# Altium project interface.PrjPcb
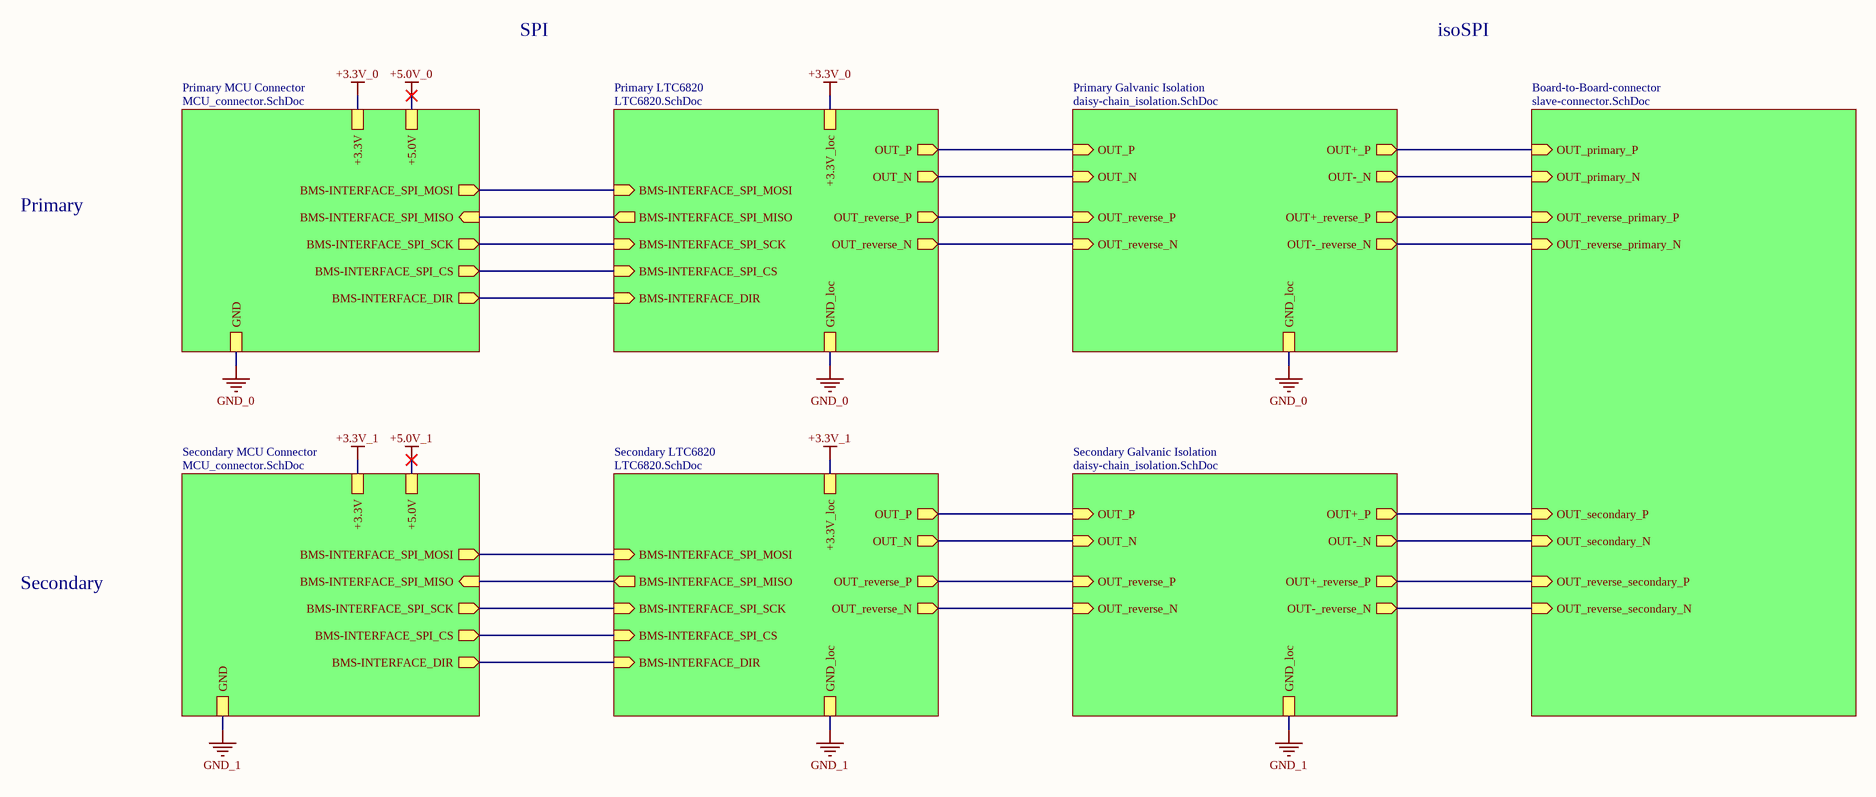
[diagram p0: overview.SchDoc]
GlobalDate: 2019-03-15; GlobalLicense: Creative Commons Attribution 4.0; GlobalProject: foxBMS BMS-Interface; GlobalVersion: 1.9.4
6 sheets, 74 parts. Net scope: strictly hierarchical (ports join the sheet entries above them; power ports are local).
Board file: interface.PcbDoc
Sheets:
  overview.SchDoc
    Primary LTC6820 = LTC6820.SchDoc
      LTC6820 forward = LTC6820_chip.SchDoc
      LTC6820 reverse = LTC6820_chip.SchDoc
    Primary Galvanic Isolation = daisy-chain_isolation.SchDoc
    Secondary LTC6820 = LTC6820.SchDoc
      LTC6820 forward = LTC6820_chip.SchDoc
      LTC6820 reverse = LTC6820_chip.SchDoc
    Secondary Galvanic Isolation = daisy-chain_isolation.SchDoc
    Board-to-Board-connector = slave-connector.SchDoc
    Primary MCU Connector = MCU_connector.SchDoc
    Secondary MCU Connector = MCU_connector.SchDoc

## Sheet overview.SchDoc: foxBMS BMS-Interface
size A3; DocumentNumber: 1; SheetNumber: 1; SheetTotal: 6; Author: Fraunhofer IISB foxBMS Team; REL-DATE: 2017-05-09; VERSION: 1.1.0; GateName_1: G$1; SymbolName_1: FRAME_B_L; LibraryName: foxBMS_BMS-Master_V1.00_A; DeviceSetName: FRAME_B_L; GateName_2: G$2; SymbolName_2: DOCFIELD; SheetDescription: Structure of Interface

### Sub-sheets
Board-to-Board-connector = slave-connector.SchDoc: OUT_secondary_N (in), OUT_secondary_P (in), OUT_primary_P (in), OUT_reverse_primary_N (in), OUT_primary_N (in), OUT_reverse_primary_P (in), OUT_reverse_secondary_P (in), OUT_reverse_secondary_N (in)
Primary Galvanic Isolation = daisy-chain_isolation.SchDoc: OUT_P (in), OUT_N (in), OUT+_P (out), OUT-_N (out), GND_loc, OUT_reverse_N (in), OUT_reverse_P (in), OUT+_reverse_P (out), OUT-_reverse_N (out)
Primary LTC6820 = LTC6820.SchDoc: BMS-INTERFACE_SPI_CS (in), BMS-INTERFACE_SPI_SCK (in), BMS-INTERFACE_SPI_MOSI (in), BMS-INTERFACE_SPI_MISO (out), OUT_P (out), OUT_N (out), +3.3V_loc, GND_loc, OUT_reverse_P (out), OUT_reverse_N (out), BMS-INTERFACE_DIR (in)
Primary MCU Connector = MCU_connector.SchDoc: GND, +3.3V, +5.0V, BMS-INTERFACE_SPI_MOSI (out), BMS-INTERFACE_SPI_MISO (in), BMS-INTERFACE_SPI_SCK (out), BMS-INTERFACE_SPI_CS (out), BMS-INTERFACE_DIR (out)
Secondary Galvanic Isolation = daisy-chain_isolation.SchDoc: OUT+_P (out), OUT-_N (out), OUT_P (in), OUT_N (in), GND_loc, OUT_reverse_P (in), OUT_reverse_N (in), OUT+_reverse_P (out), OUT-_reverse_N (out)
Secondary LTC6820 = LTC6820.SchDoc: BMS-INTERFACE_SPI_CS (in), BMS-INTERFACE_SPI_MOSI (in), BMS-INTERFACE_SPI_MISO (out), BMS-INTERFACE_SPI_SCK (in), OUT_N (out), OUT_P (out), +3.3V_loc, GND_loc, OUT_reverse_P (out), OUT_reverse_N (out), BMS-INTERFACE_DIR (in)
Secondary MCU Connector = MCU_connector.SchDoc: GND, +3.3V, +5.0V, BMS-INTERFACE_SPI_MOSI (out), BMS-INTERFACE_SPI_MISO (in), BMS-INTERFACE_SPI_SCK (out), BMS-INTERFACE_SPI_CS (out), BMS-INTERFACE_DIR (out)

### Nets
+3.3V_0: sheet Primary LTC6820/+3.3V_loc, sheet Primary MCU Connector/+3.3V
+3.3V_1: sheet Secondary LTC6820/+3.3V_loc, sheet Secondary MCU Connector/+3.3V
GND_0: sheet Primary LTC6820/GND_loc, sheet Primary Galvanic Isolation/GND_loc, sheet Primary MCU Connector/GND
GND_1: sheet Secondary LTC6820/GND_loc, sheet Secondary Galvanic Isolation/GND_loc, sheet Secondary MCU Connector/GND
BMS-INTERFACE_DIR: sheet Primary LTC6820/BMS-INTERFACE_DIR, sheet Primary MCU Connector/BMS-INTERFACE_DIR
BMS-INTERFACE_DIR: sheet Secondary LTC6820/BMS-INTERFACE_DIR, sheet Secondary MCU Connector/BMS-INTERFACE_DIR  [a separate net that carries the same name]
BMS-INTERFACE_SPI_MISO: sheet Primary LTC6820/BMS-INTERFACE_SPI_MISO, sheet Primary MCU Connector/BMS-INTERFACE_SPI_MISO
BMS-INTERFACE_SPI_MISO: sheet Secondary LTC6820/BMS-INTERFACE_SPI_MISO, sheet Secondary MCU Connector/BMS-INTERFACE_SPI_MISO  [a separate net that carries the same name]
BMS-INTERFACE_SPI_MOSI: sheet Primary LTC6820/BMS-INTERFACE_SPI_MOSI, sheet Primary MCU Connector/BMS-INTERFACE_SPI_MOSI
BMS-INTERFACE_SPI_MOSI: sheet Secondary LTC6820/BMS-INTERFACE_SPI_MOSI, sheet Secondary MCU Connector/BMS-INTERFACE_SPI_MOSI  [a separate net that carries the same name]
BMS-INTERFACE_SPI_SCK: sheet Primary LTC6820/BMS-INTERFACE_SPI_SCK, sheet Primary MCU Connector/BMS-INTERFACE_SPI_SCK
BMS-INTERFACE_SPI_SCK: sheet Secondary LTC6820/BMS-INTERFACE_SPI_SCK, sheet Secondary MCU Connector/BMS-INTERFACE_SPI_SCK  [a separate net that carries the same name]
~{CS}: sheet Primary LTC6820/BMS-INTERFACE_SPI_CS, sheet Primary MCU Connector/BMS-INTERFACE_SPI_CS
~{CS}: sheet Secondary LTC6820/BMS-INTERFACE_SPI_CS, sheet Secondary MCU Connector/BMS-INTERFACE_SPI_CS  [a separate net that carries the same name]
OUT_N: sheet Primary LTC6820/OUT_N, sheet Primary Galvanic Isolation/OUT_N
OUT_N: sheet Primary LTC6820/OUT_reverse_N, sheet Primary Galvanic Isolation/OUT_reverse_N  [a separate net that carries the same name]
OUT_N: sheet Secondary LTC6820/OUT_N, sheet Secondary Galvanic Isolation/OUT_N  [a separate net that carries the same name]
OUT_N: sheet Secondary LTC6820/OUT_reverse_N, sheet Secondary Galvanic Isolation/OUT_reverse_N  [a separate net that carries the same name]
OUT_P: sheet Primary LTC6820/OUT_P, sheet Primary Galvanic Isolation/OUT_P
OUT_P: sheet Primary LTC6820/OUT_reverse_P, sheet Primary Galvanic Isolation/OUT_reverse_P  [a separate net that carries the same name]
OUT_P: sheet Secondary LTC6820/OUT_P, sheet Secondary Galvanic Isolation/OUT_P  [a separate net that carries the same name]
OUT_P: sheet Secondary LTC6820/OUT_reverse_P, sheet Secondary Galvanic Isolation/OUT_reverse_P  [a separate net that carries the same name]
OUT_primary_N: sheet Primary Galvanic Isolation/OUT-_N, sheet Board-to-Board-connector/OUT_primary_N
OUT_primary_P: sheet Primary Galvanic Isolation/OUT+_P, sheet Board-to-Board-connector/OUT_primary_P
OUT_reverse_primary_N: sheet Primary Galvanic Isolation/OUT-_reverse_N, sheet Board-to-Board-connector/OUT_reverse_primary_N
OUT_reverse_primary_P: sheet Primary Galvanic Isolation/OUT+_reverse_P, sheet Board-to-Board-connector/OUT_reverse_primary_P
OUT_reverse_secondary_N: sheet Secondary Galvanic Isolation/OUT-_reverse_N, sheet Board-to-Board-connector/OUT_reverse_secondary_N
OUT_reverse_secondary_P: sheet Secondary Galvanic Isolation/OUT+_reverse_P, sheet Board-to-Board-connector/OUT_reverse_secondary_P
OUT_secondary_N: sheet Secondary Galvanic Isolation/OUT-_N, sheet Board-to-Board-connector/OUT_secondary_N
OUT_secondary_P: sheet Secondary Galvanic Isolation/OUT+_P, sheet Board-to-Board-connector/OUT_secondary_P

### Notes on the sheet
- SPI
- isoSPI
- Primary
- Secondary
- Fraunhofer IISB
- Schottkystr. 10
- developed by:
- 91058 Erlangen
- Germany
- Author
- Project
- License
- Description
- File
- Version
- Release Date
- Sheet
- www.foxbms.org
- www.iisb.fraunhofer.de
- foxBMS Team
- /

## Sheet LTC6820.SchDoc: foxBMS BMS-Interface
size A3; DocumentNumber: 3; SheetNumber: 3; SheetTotal: 6; Author: Fraunhofer IISB foxBMS Team; REL-DATE: 2017-05-09; VERSION: 1.1.0; GateName_1: G$1; SymbolName_1: FRAME_B_L; LibraryName: foxBMS_BMS-Master_V1.00_A; DeviceSetName: FRAME_B_L; GateName_2: G$2; SymbolName_2: DOCFIELD; SheetDescription: Two LTC6820 for forward and reverese isoSPI
Used 2 times, as channels Primary LTC6820, Secondary LTC6820. Parts and nets are listed once, with the designators drawn on the sheet.
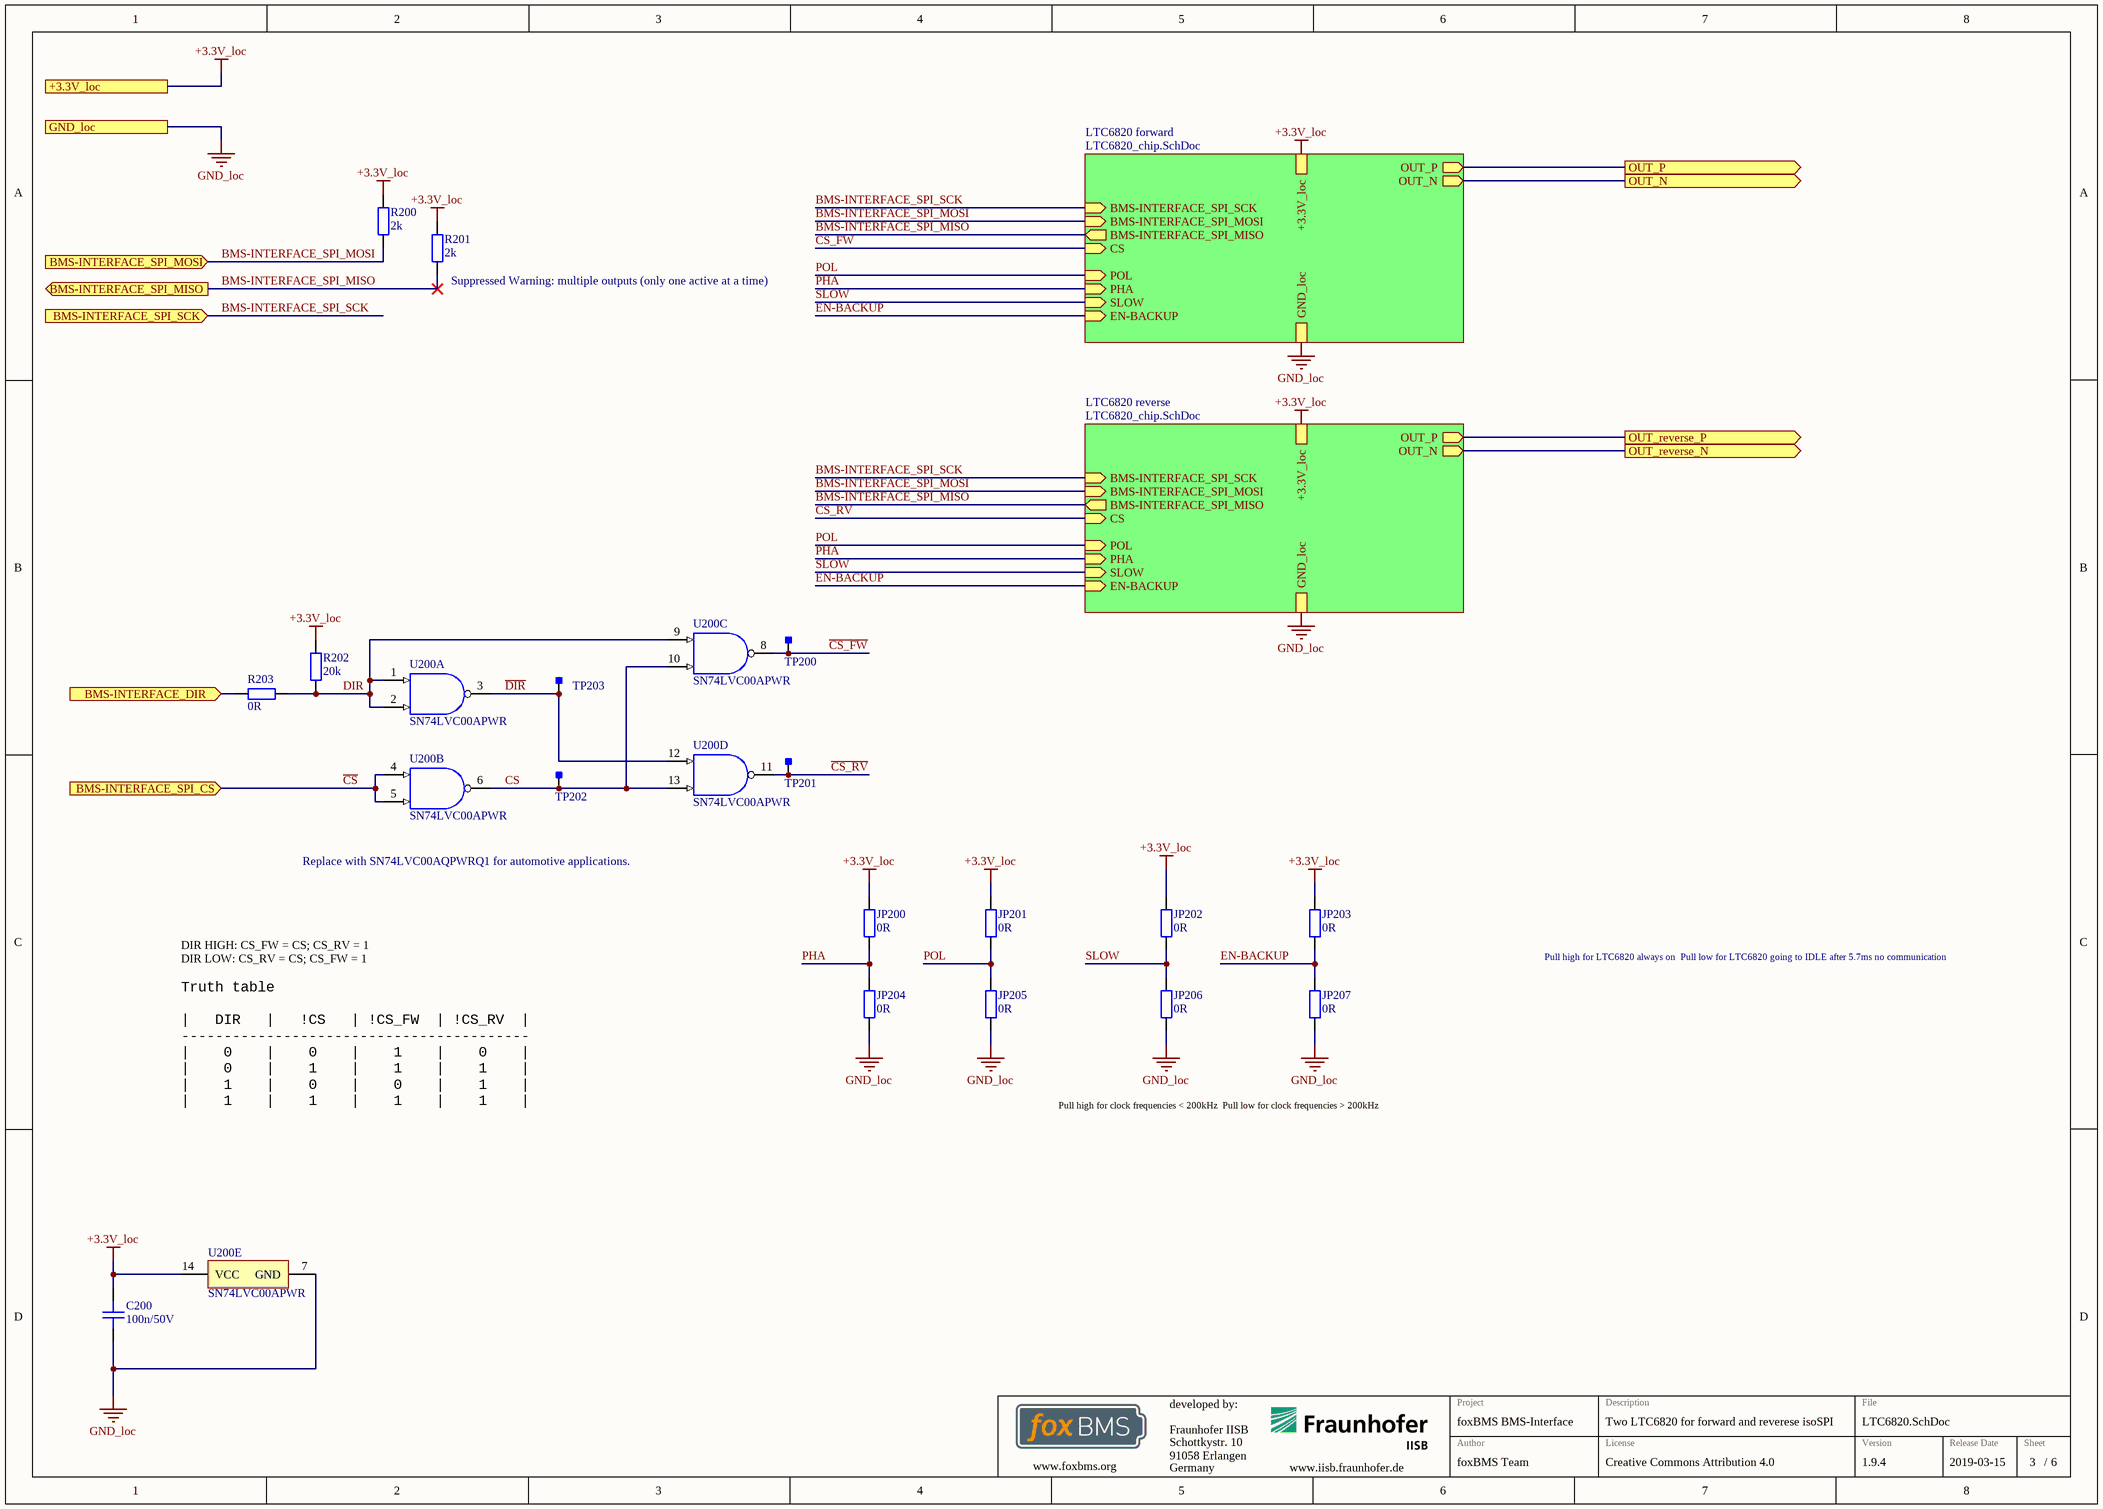
[diagram p1: LTC6820.SchDoc]

### Parts
C200  100n/50V  [CAPC1608X08N]
JP200  0R  [RESC1608X05N]
JP201  0R  [RESC1608X05N]
JP202  0R  [RESC1608X05N]
JP203  0R  [RESC1608X05N]
JP204  0R  [RESC1608X05N]
JP205  0R  [RESC1608X05N]
JP206  0R  [RESC1608X05N]
JP207  0R  [RESC1608X05N]
R200  2k  [RESC1608X05N]
R201  2k  [RESC1608X05N]
R202  20k  [RESC1608X05N]
R203  0R  [RESC1608X05N]
TP200  Testpoint_Square  [Testpoint_S1]  (value not drawn)  (no BOM)
TP201  Testpoint_Square  [Testpoint_S1]  (value not drawn)  (no BOM)
TP202  Testpoint_Square  [Testpoint_S1]  (value not drawn)  (no BOM)
TP203  Testpoint_Square  [Testpoint_S1]  (value not drawn)  (no BOM)
U200  SN74LVC00APWR  [PW0014A_M]  (parts A,B,C,D,E of 5)

### Sub-sheets
LTC6820 forward = LTC6820_chip.SchDoc: OUT_P (out), OUT_N (out), +3.3V_loc, GND_loc, BMS-INTERFACE_SPI_MISO (out), BMS-INTERFACE_SPI_SCK (in), BMS-INTERFACE_SPI_MOSI (in), POL (in), PHA (in), SLOW (in), EN-BACKUP (in), CS (in)
LTC6820 reverse = LTC6820_chip.SchDoc: OUT_P (out), OUT_N (out), +3.3V_loc, GND_loc, BMS-INTERFACE_SPI_MISO (out), BMS-INTERFACE_SPI_SCK (in), BMS-INTERFACE_SPI_MOSI (in), POL (in), PHA (in), SLOW (in), EN-BACKUP (in), CS (in)

### Ports
+3.3V_loc, BMS-INTERFACE_DIR (in), BMS-INTERFACE_SPI_CS (in), BMS-INTERFACE_SPI_MISO (out), BMS-INTERFACE_SPI_MOSI (in), BMS-INTERFACE_SPI_SCK (in), GND_loc, OUT_N (out), OUT_P (out), OUT_reverse_N (out), OUT_reverse_P (out)

### Nets
+3.3V_loc: C200.2 JP200.2 JP201.2 JP202.2 JP203.2 R200.2 R201.2 R202.2 U200.14(VCC) ; port +3.3V_loc, sheet LTC6820 forward/+3.3V_loc, sheet LTC6820 reverse/+3.3V_loc
GND_loc: C200.1 JP204.1 JP205.1 JP206.1 JP207.1 U200.7(GND) ; port GND_loc, sheet LTC6820 forward/GND_loc, sheet LTC6820 reverse/GND_loc
BMS-INTERFACE_DIR: R203.1 ; port BMS-INTERFACE_DIR
BMS-INTERFACE_SPI_MISO: R201.1 ; port BMS-INTERFACE_SPI_MISO, sheet LTC6820 forward/BMS-INTERFACE_SPI_MISO, sheet LTC6820 reverse/BMS-INTERFACE_SPI_MISO
BMS-INTERFACE_SPI_MOSI: R200.1 ; port BMS-INTERFACE_SPI_MOSI, sheet LTC6820 forward/BMS-INTERFACE_SPI_MOSI, sheet LTC6820 reverse/BMS-INTERFACE_SPI_MOSI
BMS-INTERFACE_SPI_SCK: port BMS-INTERFACE_SPI_SCK, sheet LTC6820 forward/BMS-INTERFACE_SPI_SCK, sheet LTC6820 reverse/BMS-INTERFACE_SPI_SCK
~{CS}: U200.4(2A) U200.5(2B) ; port BMS-INTERFACE_SPI_CS
~{CS_FW}: TP200.1 U200.8(3Y) ; sheet LTC6820 forward/CS
~{CS_RV}: TP201.1 U200.11(4Y) ; sheet LTC6820 reverse/CS
CS: TP202.1 U200.6(2Y) U200.10(3B) U200.13(4B)  [project net CS_3]
~{DIR}: TP203.1 U200.3(1Y) U200.12(4A)  [project net ~{DIR}_3]
DIR: R202.1 R203.2 U200.1(1A) U200.2(1B) U200.9(3A)  [project net DIR_3]
EN-BACKUP: JP203.1 JP207.2 ; sheet LTC6820 forward/EN-BACKUP, sheet LTC6820 reverse/EN-BACKUP
OUT_N: port OUT_N, sheet LTC6820 forward/OUT_N
OUT_P: port OUT_P, sheet LTC6820 forward/OUT_P
OUT_reverse_N: port OUT_reverse_N, sheet LTC6820 reverse/OUT_N
OUT_reverse_P: port OUT_reverse_P, sheet LTC6820 reverse/OUT_P
PHA: JP200.1 JP204.2 ; sheet LTC6820 forward/PHA, sheet LTC6820 reverse/PHA
POL: JP201.1 JP205.2 ; sheet LTC6820 forward/POL, sheet LTC6820 reverse/POL
SLOW: JP202.1 JP206.2 ; sheet LTC6820 forward/SLOW, sheet LTC6820 reverse/SLOW

### Channels
Primary LTC6820: designators end in _1; ports +3.3V_loc=+3.3V_0 BMS-INTERFACE_DIR=BMS-INTERFACE_DIR BMS-INTERFACE_SPI_CS=~{CS} BMS-INTERFACE_SPI_MISO=BMS-INTERFACE_SPI_MISO BMS-INTERFACE_SPI_MOSI=BMS-INTERFACE_SPI_MOSI BMS-INTERFACE_SPI_SCK=BMS-INTERFACE_SPI_SCK GND_loc=GND_0 OUT_N=OUT_N OUT_P=OUT_P OUT_reverse_N=OUT_N OUT_reverse_P=OUT_P
Secondary LTC6820: designators end in _2; ports +3.3V_loc=+3.3V_1 BMS-INTERFACE_DIR=BMS-INTERFACE_DIR BMS-INTERFACE_SPI_CS=~{CS} BMS-INTERFACE_SPI_MISO=BMS-INTERFACE_SPI_MISO BMS-INTERFACE_SPI_MOSI=BMS-INTERFACE_SPI_MOSI BMS-INTERFACE_SPI_SCK=BMS-INTERFACE_SPI_SCK GND_loc=GND_1 OUT_N=OUT_N OUT_P=OUT_P OUT_reverse_N=OUT_N OUT_reverse_P=OUT_P

### Notes on the sheet
- (near R201) Suppressed Warning: multiple outputs (only one active at a time)
- Replace with SN74LVC00AQPWRQ1 for automotive applications.
- DIR HIGH: CS_FW = CS; CS_RV = 1
  DIR LOW: CS_RV = CS; CS_FW = 1
- Pull high for LTC6820 always on
  Pull low for LTC6820 going to IDLE after 5.7ms no communication
- Truth table
  |   DIR   |   !CS   | !CS_FW  | !CS_RV  |
  -----------------------------------------
  |    0    |    0    |    1    |    0    |
  |    0    |    1    |    1    |    1    |
  |    1    |    0    |    0    |    1    |
  |    1    |    1    |    1    |    1    |
- Pull high for clock frequencies < 200kHz
  Pull low for clock frequencies > 200kHz
- Fraunhofer IISB
- Schottkystr. 10
- developed by:
- 91058 Erlangen
- Germany
- Author
- Project
- License
- Description
- File
- Version
- Release Date
- Sheet
- www.foxbms.org
- www.iisb.fraunhofer.de
- foxBMS Team
- /

### Library data of the parts
C200 = gen_C_ceramic_100n_50V_X7R_0603: MLCC; Capacitance: 100n; Rated Voltage: 50V; Dielectric: X7R; Case EIA: 0603; Case Metric: 1608; PnP Package: C_0603_10; PnP Value: 100n/50V/X7R; PnP equipped: x; Automotive Qualified: True; Part Number: gen_C_ceramic_100n_50V_X7R_0603; Supplier 1: Farnell; Supplier Part Number 1: 2525267; Supplier 2: Digikey; Supplier Part Number 2: 490-6049-1-ND; Supplier 3: Farnell; Supplier Part Number 3: 2070398
JP200-JP207 R203 = gen_R_0R_0603: SMD Resistor 0R 0603; Power: 0.1W; Case EIA: 0603; Case Metric: 1608; Maximum Working Voltage: 75V; PnP Package: R_0603; Automotive Qualified: True; Part Number: gen_R_0R_0603; Operating Temperature: -55°C - +155°C; Resistance: 0R; Series: Jumper; PnP Value: 0R; Supplier 1: Farnell; Supplier Part Number 1: 2616580
R200 R201 = gen_R_2k_0603: SMD Resistor 2k 0603; Tolerance: 1%; Power: 0.1W; Case EIA: 0603; Case Metric: 1608; Maximum Working Voltage: 75V; PnP Package: R_0603; Automotive Qualified: True; Part Number: gen_R_2k_0603; Operating Temperature: -55°C - +155°C; Resistance: 2k; Series: E24, E96; PnP Value: 2k; Supplier 1: Farnell; Supplier Part Number 1: 2059343
R202 = gen_R_20k_0603: SMD Resistor 20k 0603; Tolerance: 1%; Power: 0.1W; Case EIA: 0603; Case Metric: 1608; Maximum Working Voltage: 75V; PnP Package: R_0603; Automotive Qualified: True; Part Number: gen_R_20k_0603; Operating Temperature: -55°C - +155°C; Resistance: 20k; Series: E24, E96; PnP Value: 20k; Supplier 1: Farnell; Supplier Part Number 1: 2059432
TP200-TP203 = Testpoint_Square: Testpoint, square; Part Number: Testpoint_Square
U200 = CMP-1627-00586-2: Quadruple 2-Input Positive-NAND Gate, PW0014A, LARGE T&R; Manufacturer: Texas Instruments; Rating: Catalog; Voltage(Nom)(V): 1.8,2.5,2.7,3.3; F @ Nom Voltage(Max)(Mhz): 150; VCC(Min)(V): 1.65; Input Type: TTL; VCC(Max)(V): 3.6; Technology Family: LVC; Output Drive (IOL/IOH)(Max)(mA): 24/-24; ICC @ Nom Voltage(Max)(mA): 0.04; Schmitt Trigger: No; tpd @ Nom Voltage(Max)(ns): 12.5,6.4,5.1,4.3; DatasheetVersion: SCAS279Q; Generic Part Number: SN74LVC00A; Code_JEDEC: MO-153; Operating Temperature Range(C): -40 to 125; Output Type: TTL; PackageReference: PW0014A

## Sheet LTC6820_chip.SchDoc
size A3; DocumentNumber: 6; SheetNumber: 6; SheetTotal: 6; SheetDescription: LTC6820
Used 4 times, as channels Primary LTC6820/LTC6820 forward, Primary LTC6820/LTC6820 reverse, Secondary LTC6820/LTC6820 forward, Secondary LTC6820/LTC6820 reverse. Parts and nets are listed once, with the designators drawn on the sheet.
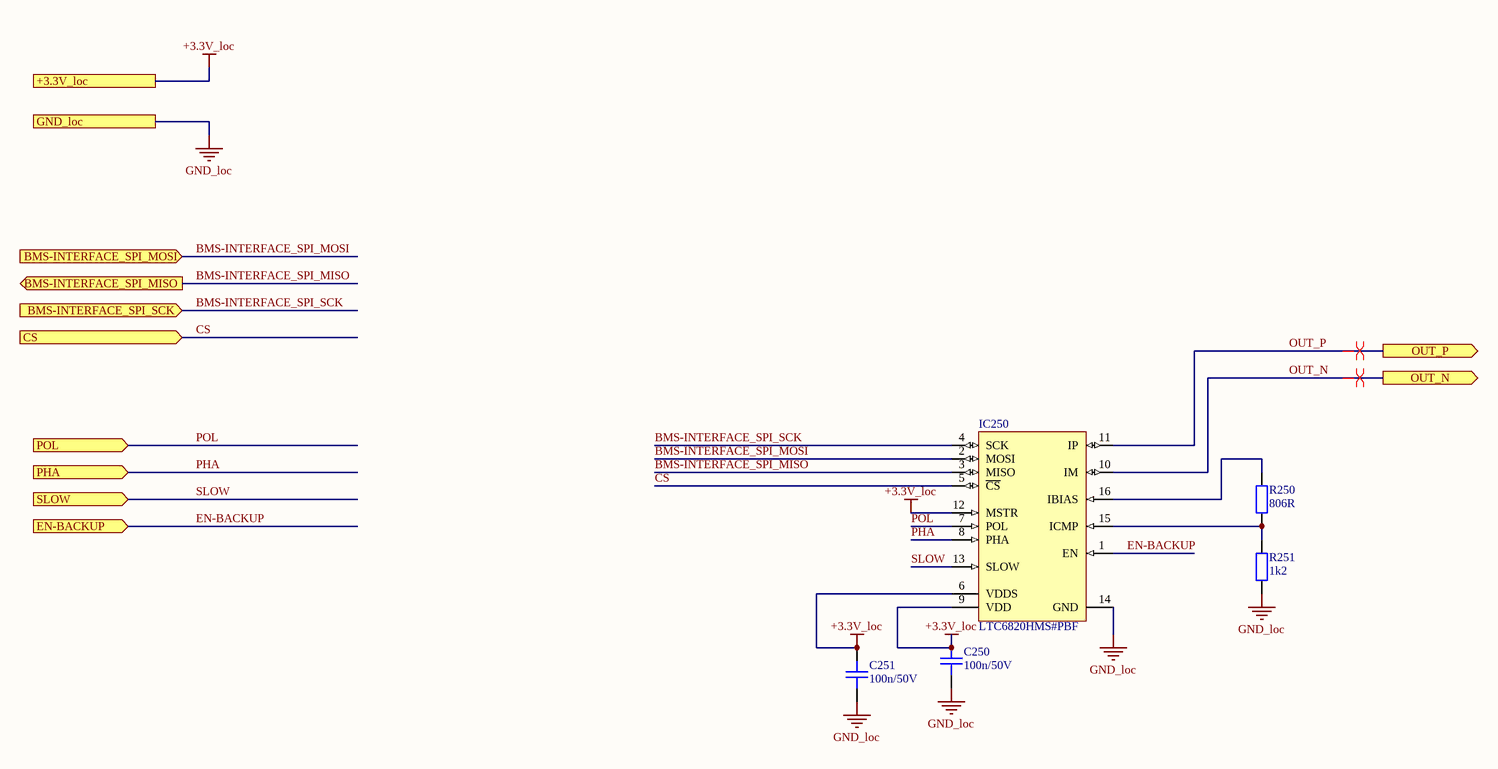
[diagram p2: LTC6820_chip.SchDoc]

### Parts
C250  100n/50V  [CAPC1608X08N]
C251  100n/50V  [CAPC1608X08N]
IC250  LTC6820HMS#PBF  [LT-MS-16_M]
R250  806R  [RESC1608X05N]
R251  1k2  [RESC1608X05N]

### Ports
+3.3V_loc, BMS-INTERFACE_SPI_MISO (out), BMS-INTERFACE_SPI_MOSI (in), BMS-INTERFACE_SPI_SCK (in), CS (in), EN-BACKUP (in), GND_loc, OUT_N (out), OUT_P (out), PHA (in), POL (in), SLOW (in)

### Nets
+3.3V_loc: C250.2 C251.2 IC250.6(VDDS) IC250.9(VDD) IC250.12(MSTR) ; port +3.3V_loc
GND_loc: C250.1 C251.1 IC250.14(GND) R251.1 ; port GND_loc
BMS-INTERFACE_SPI_MISO: IC250.3(MISO) ; port BMS-INTERFACE_SPI_MISO
BMS-INTERFACE_SPI_MOSI: IC250.2(MOSI) ; port BMS-INTERFACE_SPI_MOSI
BMS-INTERFACE_SPI_SCK: IC250.4(SCK) ; port BMS-INTERFACE_SPI_SCK
CS: IC250.5(~{CS}) ; port CS
EN-BACKUP: IC250.1(EN) ; port EN-BACKUP
OUT_N: IC250.10(IM) ; port OUT_N
OUT_P: IC250.11(IP) ; port OUT_P
PHA: IC250.8(PHA) ; port PHA
POL: IC250.7(POL) ; port POL
SLOW: IC250.13(SLOW) ; port SLOW
NetIC250_15: IC250.15(ICMP) R250.1 R251.2
NetIC250_16: IC250.16(IBIAS) R250.2

### Channels
Primary LTC6820/LTC6820 forward: designators end in _1; ports +3.3V_loc=+3.3V_0 BMS-INTERFACE_SPI_MISO=BMS-INTERFACE_SPI_MISO BMS-INTERFACE_SPI_MOSI=BMS-INTERFACE_SPI_MOSI BMS-INTERFACE_SPI_SCK=BMS-INTERFACE_SPI_SCK CS=~{CS_FW}_Primary LTC6820 EN-BACKUP=EN-BACKUP_Primary LTC6820 GND_loc=GND_0 OUT_N=OUT_N OUT_P=OUT_P PHA=PHA_Primary LTC6820 POL=POL_Primary LTC6820 SLOW=SLOW_Primary LTC6820
Primary LTC6820/LTC6820 reverse: designators end in _2; ports +3.3V_loc=+3.3V_0 BMS-INTERFACE_SPI_MISO=BMS-INTERFACE_SPI_MISO BMS-INTERFACE_SPI_MOSI=BMS-INTERFACE_SPI_MOSI BMS-INTERFACE_SPI_SCK=BMS-INTERFACE_SPI_SCK CS=~{CS_RV}_Primary LTC6820 EN-BACKUP=EN-BACKUP_Primary LTC6820 GND_loc=GND_0 OUT_N=OUT_N OUT_P=OUT_P PHA=PHA_Primary LTC6820 POL=POL_Primary LTC6820 SLOW=SLOW_Primary LTC6820
Secondary LTC6820/LTC6820 forward: designators end in _3; ports +3.3V_loc=+3.3V_1 BMS-INTERFACE_SPI_MISO=BMS-INTERFACE_SPI_MISO BMS-INTERFACE_SPI_MOSI=BMS-INTERFACE_SPI_MOSI BMS-INTERFACE_SPI_SCK=BMS-INTERFACE_SPI_SCK CS=~{CS_FW}_Secondary LTC6820 EN-BACKUP=EN-BACKUP_Secondary LTC6820 GND_loc=GND_1 OUT_N=OUT_N OUT_P=OUT_P PHA=PHA_Secondary LTC6820 POL=POL_Secondary LTC6820 SLOW=SLOW_Secondary LTC6820
Secondary LTC6820/LTC6820 reverse: designators end in _4; ports +3.3V_loc=+3.3V_1 BMS-INTERFACE_SPI_MISO=BMS-INTERFACE_SPI_MISO BMS-INTERFACE_SPI_MOSI=BMS-INTERFACE_SPI_MOSI BMS-INTERFACE_SPI_SCK=BMS-INTERFACE_SPI_SCK CS=~{CS_RV}_Secondary LTC6820 EN-BACKUP=EN-BACKUP_Secondary LTC6820 GND_loc=GND_1 OUT_N=OUT_N OUT_P=OUT_P PHA=PHA_Secondary LTC6820 POL=POL_Secondary LTC6820 SLOW=SLOW_Secondary LTC6820

### Layout directives
differential pair: OUT_N, OUT_P

### Notes on the sheet
- Fraunhofer IISB
- Schottkystr. 10
- developed by:
- 91058 Erlangen
- Germany
- Author
- Project
- License
- Description
- File
- Version
- Release Date
- Sheet
- www.foxbms.org
- www.iisb.fraunhofer.de
- foxBMS Team
- /

### Library data of the parts
C250 C251 = gen_C_ceramic_100n_50V_X7R_0603: as C200 on sheet LTC6820; Part Number: gen_C_ceramic_100n_50V_X7R_0603; Supplier 1: Farnell; Supplier Part Number 1: 2525267; Supplier 2: Digikey; Supplier Part Number 2: 490-6049-1-ND; Supplier 3: Farnell; Supplier Part Number 3: 2070398
IC250 = CMP-0937-00009-1: IsoSPI Isolated Communication Interface, 2.7 to 5.5 V, -40 to 125 degC, 16-Pin MSOP (MS), Pb-Free; Manufacturer: Linear Technology; IO Supply Current: 1 uA Max.; IO Supply Voltage Range: 1.7 to 5.5 V; Receiver Input Resistance: 35 kOhm; VBIAS: 1.9 to 2.1 V; Supply Current, IDLE State: 2 uA; ComponentLink3Description: Package Specification; Mounting Technology: Surface Mount; ComponentLink2URL: http://cds.linear.com/docs/en/datasheet/6820fa.pdf; PackageVersion: Rev. A; PackageReference: MS-16; PackageDescription: 16-Pin Micro Small Outline Package, Body 4.039 x 3 mm, Pitch 0.5 mm; ComponentLink3URL: http://cds.linear.com/docs/en/packaging/05081669_A_MS16.pdf; DatasheetVersion: Rev. A; Power Supply: 2.7 to 5.5 V; ComponentLink1Description: Manufacturer URL; PartNumber: LTC6820HMS#PBF; Temperature Range (degC): -40 to 125; ComponentLink1URL: http://www.linear.com/; ComponentLink2Description: Datasheet
R250 = gen_R_806R_0603: SMD Resistor 806R 0603; Tolerance: 1%; Power: 0.1W; Case EIA: 0603; Case Metric: 1608; Maximum Working Voltage: 75V; PnP Package: R_0603; Automotive Qualified: True; Part Number: gen_R_806R_0603; Operating Temperature: -55°C - +155°C; Resistance: 806R; Series: E96; PnP Value: 806R; Supplier 1: Farnell; Supplier Part Number 1: 2059324
R251 = gen_R_1k2_0603: SMD Resistor 1k2 0603; Tolerance: 1%; Power: 0.1W; Case EIA: 0603; Case Metric: 1608; Maximum Working Voltage: 75V; PnP Package: R_0603; Automotive Qualified: True; Part Number: gen_R_1k2_0603; Operating Temperature: -55°C - +155°C; Resistance: 1k2; Series: E24; PnP Value: 1k2; Supplier 1: Farnell; Supplier Part Number 1: 2073370

## Sheet daisy-chain_isolation.SchDoc: foxBMS BMS-Interface
size A3; DocumentNumber: 4; SheetNumber: 4; SheetTotal: 6; Author: Fraunhofer IISB foxBMS Team; REL-DATE: 2017-05-09; VERSION: 1.1.0; GateName_1: G$1; SymbolName_1: FRAME_B_L; LibraryName: foxBMS_BMS-Master_V1.00_A; DeviceSetName: FRAME_B_L; GateName_2: G$2; SymbolName_2: DOCFIELD; SheetDescription: Daisy Chain Isolation
Used 2 times, as channels Primary Galvanic Isolation, Secondary Galvanic Isolation. Parts and nets are listed once, with the designators drawn on the sheet.
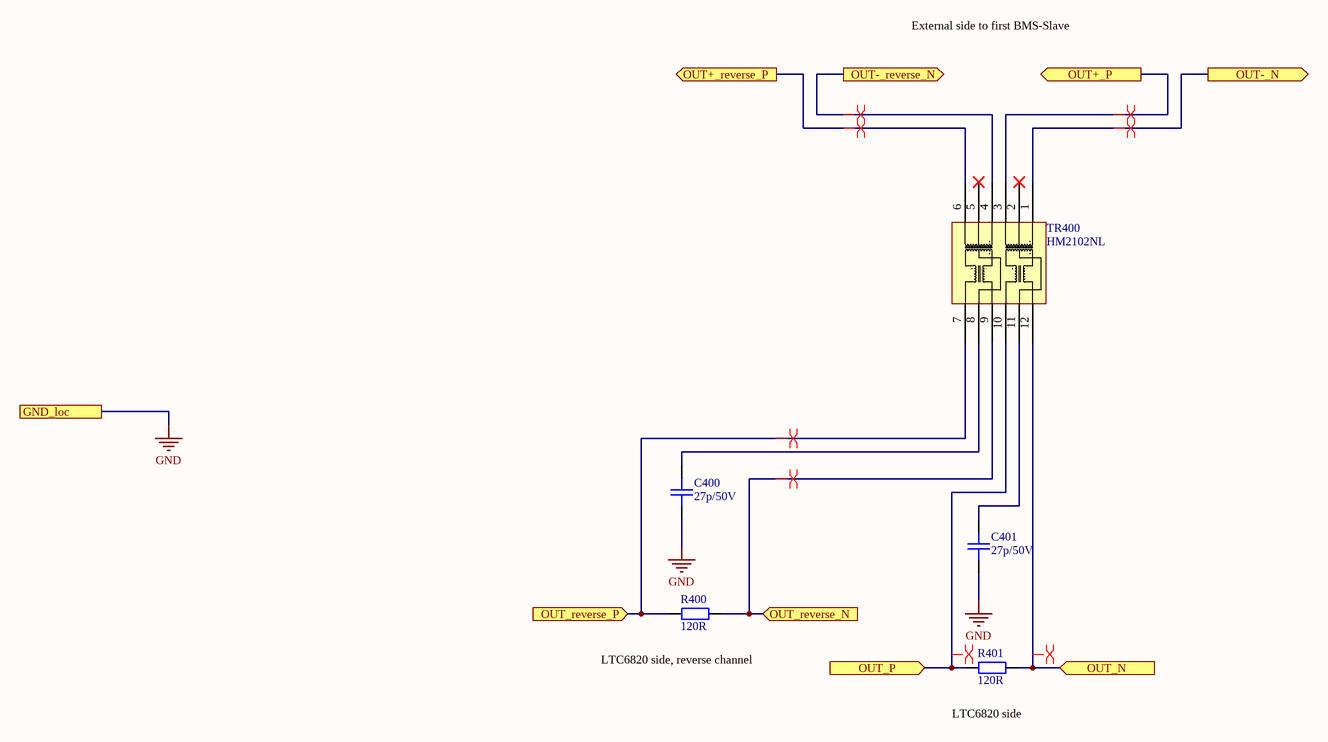
[diagram p3: daisy-chain_isolation.SchDoc]

### Parts
C400  27p/50V  [CAPC1608X08N]
C401  27p/50V  [CAPC1608X08N]
R400  120R  [RESC1608X05N]
R401  120R  [RESC1608X05N]
TR400  HM2102NL  [HM2102NL]

### Ports
GND_loc, OUT+_P (out), OUT+_reverse_P (out), OUT-_N (out), OUT-_reverse_N (out), OUT_N (in), OUT_P (in), OUT_reverse_N (in), OUT_reverse_P (in)

### Nets
GND: C400.1 C401.1 ; port GND_loc
OUT+_P: TR400.3 ; port OUT+_P
OUT+_reverse_P: TR400.6 ; port OUT+_reverse_P
OUT-_N: TR400.1 ; port OUT-_N
OUT-_reverse_N: TR400.4 ; port OUT-_reverse_N
OUT_N: R401.2 TR400.12 ; port OUT_N
OUT_P: R401.1 TR400.10 ; port OUT_P
OUT_reverse_N: R400.2 TR400.9 ; port OUT_reverse_N
OUT_reverse_P: R400.1 TR400.7 ; port OUT_reverse_P
NetC400_2: C400.2 TR400.8
NetC401_2: C401.2 TR400.11

Not connected (* = marked no-connect by the designer): TR400 2* 5*

### Channels
Primary Galvanic Isolation: designators end in _1; ports GND_loc=GND_0 OUT+_P=OUT_primary_P OUT+_reverse_P=OUT_reverse_primary_P OUT-_N=OUT_primary_N OUT-_reverse_N=OUT_reverse_primary_N OUT_N=OUT_N OUT_P=OUT_P OUT_reverse_N=OUT_N OUT_reverse_P=OUT_P
Secondary Galvanic Isolation: designators end in _2; ports GND_loc=GND_1 OUT+_P=OUT_secondary_P OUT+_reverse_P=OUT_reverse_secondary_P OUT-_N=OUT_secondary_N OUT-_reverse_N=OUT_reverse_secondary_N OUT_N=OUT_N OUT_P=OUT_P OUT_reverse_N=OUT_N OUT_reverse_P=OUT_P

### Layout directives
differential pair: OUT_N, OUT_P, OUT_primary_N, OUT_primary_P, OUT_reverse_primary_N, OUT_reverse_primary_P

### Notes on the sheet
- External side to first BMS-Slave
- (near R400) LTC6820 side, reverse channel
- (near R401) LTC6820 side
- Fraunhofer IISB
- Schottkystr. 10
- developed by:
- 91058 Erlangen
- Germany
- Author
- Project
- License
- Description
- File
- Version
- Release Date
- Sheet
- www.foxbms.org
- www.iisb.fraunhofer.de
- foxBMS Team
- /

### Library data of the parts
C400 C401 = gen_C_ceramic_27p_50V_NP0_0603: MLCC; Capacitance: 27p; Rated Voltage: 50V; Dielectric: NP0; Case EIA: 0603; Case Metric: 1608; PnP Package: C_0603_05; Automotive Qualified: True; Part Number: gen_C_ceramic_27p_50V_NP0_0603; Supplier 1: Farnell; Supplier Part Number 1: 2219430; PnP Value: *
R400 R401 = gen_R_120R_0603: SMD Resistor 120R 0603; Tolerance: 1%; Power: 0.1W; Case EIA: 0603; Case Metric: 1608; Maximum Working Voltage: 75V; PnP Package: R_0603; Automotive Qualified: True; Part Number: gen_R_120R_0603; Operating Temperature: -55°C - +155°C; Resistance: 120R; Series: E24; PnP Value: 120R; Supplier 1: Farnell; Supplier Part Number 1: 1652832
TR400 = HM2102NL: Pulse HM2102NL BMS Transformer; Automotive Qualified: True; Part Number: HM2102NL; Manufacturer: Pulse; Operating Temperature: -40°C - +125°C; ComponentLink1Description: Datasheet; ComponentLink1URL: https://www.mouser.com/ds/2/336/HM2102NL-1218600.pdf; Supplier 1: Mouser; Supplier Part Number 1: 673-HM2102NL; Supplier 2: Digikey; Supplier Part Number 2: 1840-1034-1-ND

## Sheet slave-connector.SchDoc
size A3; DocumentNumber: 5; SheetNumber: 5; SheetTotal: 6; SheetDescription: Slave Connector
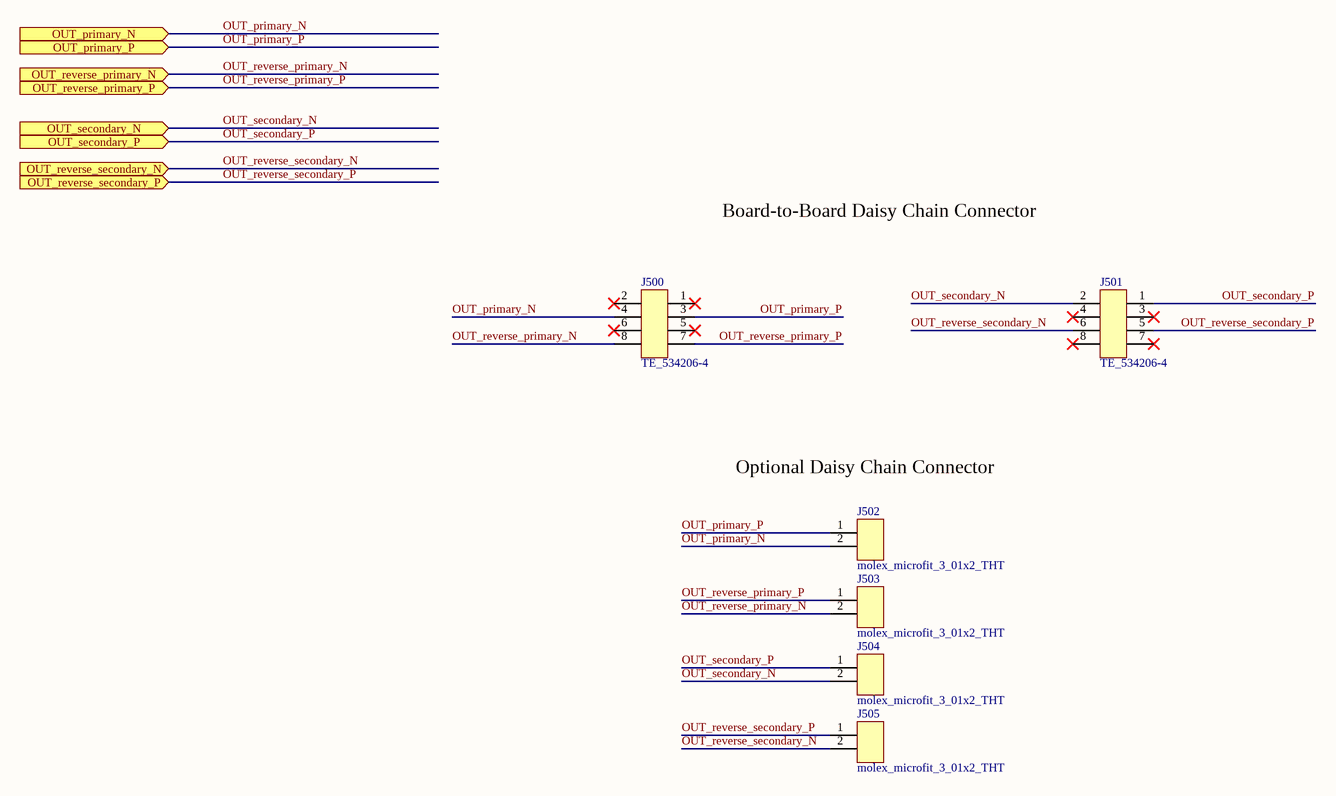
[diagram p4: slave-connector.SchDoc]

### Parts
J500  TE_534206-4  [TE_534206-4]
J501  TE_534206-4  [TE_534206-4]
J502  molex_microfit_3_01x2_THT  [MOLEX_MICROFIT_01x2_THT]
J503  molex_microfit_3_01x2_THT  [MOLEX_MICROFIT_01x2_THT]
J504  molex_microfit_3_01x2_THT  [MOLEX_MICROFIT_01x2_THT]
J505  molex_microfit_3_01x2_THT  [MOLEX_MICROFIT_01x2_THT]

### Ports
OUT_primary_N (in), OUT_primary_P (in), OUT_reverse_primary_N (in), OUT_reverse_primary_P (in), OUT_reverse_secondary_N (in), OUT_reverse_secondary_P (in), OUT_secondary_N (in), OUT_secondary_P (in)

### Nets
OUT_primary_N: J500.4 J502.2 ; port OUT_primary_N
OUT_primary_P: J500.3 J502.1 ; port OUT_primary_P
OUT_reverse_primary_N: J500.8 J503.2 ; port OUT_reverse_primary_N
OUT_reverse_primary_P: J500.7 J503.1 ; port OUT_reverse_primary_P
OUT_reverse_secondary_N: J501.6 J505.2 ; port OUT_reverse_secondary_N
OUT_reverse_secondary_P: J501.5 J505.1 ; port OUT_reverse_secondary_P
OUT_secondary_N: J501.2 J504.2 ; port OUT_secondary_N
OUT_secondary_P: J501.1 J504.1 ; port OUT_secondary_P

Not connected (* = marked no-connect by the designer): J500 1* 2* 5* 6*; J501 3* 4* 7* 8*

### Notes on the sheet
- Board-to-Board Daisy Chain Connector
- Optional Daisy Chain Connector
- Fraunhofer IISB
- Schottkystr. 10
- developed by:
- 91058 Erlangen
- Germany
- Author
- Project
- License
- Description
- File
- Version
- Release Date
- Sheet
- www.foxbms.org
- www.iisb.fraunhofer.de
- foxBMS Team
- /

### Library data of the parts
J500 J501 = TE_534206-4: Board-To-Board Connector, Dual, 2.54 mm, 8 Contacts, Receptacle, Through Hole, 2 Rows; Manufacturer: TE; Circuits: 8; Rated Voltage: 333V AC; Rated Current: 2A; Automotive Qualified: False; Part Number: TE_534206-4; Part Name: 534206-4; Operating Temperature: −65 °C - +105 °C; ComponentLink1Description: Datasheet; ComponentLink1URL: https://www.te.com/deu-de/product-534206-4.html#pdp-docs-features; Supplier 1: Digikey; Supplier Part Number 1: A26454-ND
J502-J505 = molex_microfit_3_01x2_THT: Micro-Fit 3.0 Right Angle Header, 3.00mm Pitch, Dual Row, 2 Circuits, with Snap-in Plastic Peg PCB Lock, Tin, Glow Wire Capable, Black, 43045-0200; Manufacturer: Molex; Circuits: 2; Rated Voltage: 600V; Rated Current: 8.5A; Automotive Qualified: False; Part Number: molex_microfit_3_01x2_THT; Part Name: MicroFit; Operating Temperature: -40°C - +105°C; Supplier 1: Farnell; Supplier Part Number 1: 1012251

## Sheet MCU_connector.SchDoc: foxBMS BMS-Interface
size A3; DocumentNumber: 2; SheetNumber: 2; SheetTotal: 6; Author: Fraunhofer IISB foxBMS Team; REL-DATE: 2017-05-09; VERSION: 1.1.0; GateName_1: G$1; SymbolName_1: FRAME_B_L; LibraryName: foxBMS_BMS-Master_V1.00_A; DeviceSetName: FRAME_B_L; GateName_2: G$2; SymbolName_2: DOCFIELD; SheetDescription: MCU connector
Used 2 times, as channels Primary MCU Connector, Secondary MCU Connector. Parts and nets are listed once, with the designators drawn on the sheet.
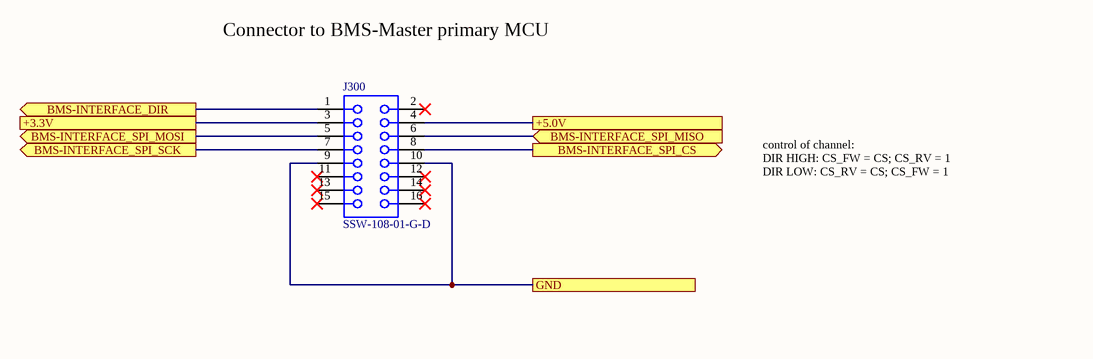
[diagram p5: MCU_connector.SchDoc]

### Parts
J300  SSW-108-01-G-D  [SMTC-SSW-108-01-X-D]

### Ports
+3.3V, +5.0V, BMS-INTERFACE_DIR (out), BMS-INTERFACE_SPI_CS (out), BMS-INTERFACE_SPI_MISO (in), BMS-INTERFACE_SPI_MOSI (out), BMS-INTERFACE_SPI_SCK (out), GND

### Nets
+3.3V: J300.3 ; port +3.3V
+5.0V: J300.4 ; port +5.0V
BMS-INTERFACE_DIR: J300.1 ; port BMS-INTERFACE_DIR
BMS-INTERFACE_SPI_CS: J300.8 ; port BMS-INTERFACE_SPI_CS
BMS-INTERFACE_SPI_MISO: J300.6 ; port BMS-INTERFACE_SPI_MISO
BMS-INTERFACE_SPI_MOSI: J300.5 ; port BMS-INTERFACE_SPI_MOSI
BMS-INTERFACE_SPI_SCK: J300.7 ; port BMS-INTERFACE_SPI_SCK
GND: J300.9 J300.10 ; port GND

Not connected (* = marked no-connect by the designer): J300 2* 11* 12* 13* 14* 15* 16*

### Channels
Primary MCU Connector: designators end in _1; ports +3.3V=+3.3V_0 +5.0V=+5.0V_0 BMS-INTERFACE_DIR=BMS-INTERFACE_DIR BMS-INTERFACE_SPI_CS=~{CS} BMS-INTERFACE_SPI_MISO=BMS-INTERFACE_SPI_MISO BMS-INTERFACE_SPI_MOSI=BMS-INTERFACE_SPI_MOSI BMS-INTERFACE_SPI_SCK=BMS-INTERFACE_SPI_SCK GND=GND_0
Secondary MCU Connector: designators end in _2; ports +3.3V=+3.3V_1 +5.0V=+5.0V_1 BMS-INTERFACE_DIR=BMS-INTERFACE_DIR BMS-INTERFACE_SPI_CS=~{CS} BMS-INTERFACE_SPI_MISO=BMS-INTERFACE_SPI_MISO BMS-INTERFACE_SPI_MOSI=BMS-INTERFACE_SPI_MOSI BMS-INTERFACE_SPI_SCK=BMS-INTERFACE_SPI_SCK GND=GND_1

### Notes on the sheet
- Connector to BMS-Master primary MCU
- control of channel:
  DIR HIGH: CS_FW = CS; CS_RV = 1
  DIR LOW: CS_RV = CS; CS_FW = 1
- Fraunhofer IISB
- Schottkystr. 10
- developed by:
- 91058 Erlangen
- Germany
- Author
- Project
- License
- Description
- File
- Version
- Release Date
- Sheet
- www.foxbms.org
- www.iisb.fraunhofer.de
- foxBMS Team
- /

### Library data of the parts
J300 = CMP-1023-00374-1: SQ Post Socket, Through-hole, Vertical, -55 to 125 degC, 2.54mm Pitch, 16-Pin, Female, RoHS; Manufacturer: Samtec; ComponentLink1Description: Manufacturer URL; DatasheetVersion: F-214; RoHS: True; Orientation: Vertical; Temperature Range: -55 to 125 degC; ComponentLink3URL: http://www.samtec.com/documents/webfiles/cpdf/SSW-1XX-XX-XXX-X-XX-XXX-XX-MKT.pdf; PackageReference: SSW-108-01-X-D; Mounting Technology: Through-hole; Pitch: 2.54 mm; ComponentLink1URL: http://www.samtec.com; ComponentLink2Description: Datasheet; PackageVersion: CA, 6/1987; PackageDescription: Assembly, Socket Strip .016 X .031 Tail; ComponentLink3Description: Package Specification; PartNumber: SSW-108-01-G-D; ComponentLink2URL: http://www.samtec.com/documents/webfiles/pdf/SSW_TH.PDF

## Nets that join several sheets
+3.3V_0: Primary LTC6820 (9 pins), Primary LTC6820/LTC6820 forward (5 pins), Primary LTC6820/LTC6820 reverse (5 pins), Primary MCU Connector (J300_1.3)
+3.3V_1: Secondary LTC6820 (9 pins), Secondary LTC6820/LTC6820 forward (5 pins), Secondary LTC6820/LTC6820 reverse (5 pins), Secondary MCU Connector (J300_2.3)
GND_0: Primary LTC6820 (6 pins), Primary LTC6820/LTC6820 forward (C250_1.1 C251_1.1 IC250_1.14 R251_1.1), Primary LTC6820/LTC6820 reverse (C250_2.1 C251_2.1 IC250_2.14 R251_2.1), Primary Galvanic Isolation (C400_1.1 C401_1.1), Primary MCU Connector (J300_1.9 J300_1.10)
GND_1: Secondary LTC6820 (6 pins), Secondary LTC6820/LTC6820 forward (C250_3.1 C251_3.1 IC250_3.14 R251_3.1), Secondary LTC6820/LTC6820 reverse (C250_4.1 C251_4.1 IC250_4.14 R251_4.1), Secondary Galvanic Isolation (C400_2.1 C401_2.1), Secondary MCU Connector (J300_2.9 J300_2.10)
BMS-INTERFACE_DIR: Primary LTC6820 (R203_1.1), Primary MCU Connector (J300_1.1)
BMS-INTERFACE_DIR: Secondary LTC6820 (R203_2.1), Secondary MCU Connector (J300_2.1)
BMS-INTERFACE_SPI_MISO: Primary LTC6820 (R201_1.1), Primary LTC6820/LTC6820 forward (IC250_1.3), Primary LTC6820/LTC6820 reverse (IC250_2.3), Primary MCU Connector (J300_1.6)
BMS-INTERFACE_SPI_MISO: Secondary LTC6820 (R201_2.1), Secondary LTC6820/LTC6820 forward (IC250_3.3), Secondary LTC6820/LTC6820 reverse (IC250_4.3), Secondary MCU Connector (J300_2.6)
BMS-INTERFACE_SPI_MOSI: Primary LTC6820 (R200_1.1), Primary LTC6820/LTC6820 forward (IC250_1.2), Primary LTC6820/LTC6820 reverse (IC250_2.2), Primary MCU Connector (J300_1.5)
BMS-INTERFACE_SPI_MOSI: Secondary LTC6820 (R200_2.1), Secondary LTC6820/LTC6820 forward (IC250_3.2), Secondary LTC6820/LTC6820 reverse (IC250_4.2), Secondary MCU Connector (J300_2.5)
BMS-INTERFACE_SPI_SCK: Primary LTC6820/LTC6820 forward (IC250_1.4), Primary LTC6820/LTC6820 reverse (IC250_2.4), Primary MCU Connector (J300_1.7)
BMS-INTERFACE_SPI_SCK: Secondary LTC6820/LTC6820 forward (IC250_3.4), Secondary LTC6820/LTC6820 reverse (IC250_4.4), Secondary MCU Connector (J300_2.7)
~{CS}: Primary LTC6820 (U200_1.4 U200_1.5), Primary MCU Connector (J300_1.8)
~{CS}: Secondary LTC6820 (U200_2.4 U200_2.5), Secondary MCU Connector (J300_2.8)
~{CS_FW}_Primary LTC6820: Primary LTC6820 (TP200_1.1 U200_1.8), Primary LTC6820/LTC6820 forward (IC250_1.5)
~{CS_FW}_Secondary LTC6820: Secondary LTC6820 (TP200_2.1 U200_2.8), Secondary LTC6820/LTC6820 forward (IC250_3.5)
~{CS_RV}_Primary LTC6820: Primary LTC6820 (TP201_1.1 U200_1.11), Primary LTC6820/LTC6820 reverse (IC250_2.5)
~{CS_RV}_Secondary LTC6820: Secondary LTC6820 (TP201_2.1 U200_2.11), Secondary LTC6820/LTC6820 reverse (IC250_4.5)
EN-BACKUP_Primary LTC6820: Primary LTC6820 (JP203_1.1 JP207_1.2), Primary LTC6820/LTC6820 forward (IC250_1.1), Primary LTC6820/LTC6820 reverse (IC250_2.1)
EN-BACKUP_Secondary LTC6820: Secondary LTC6820 (JP203_2.1 JP207_2.2), Secondary LTC6820/LTC6820 forward (IC250_3.1), Secondary LTC6820/LTC6820 reverse (IC250_4.1)
OUT_N: Primary LTC6820/LTC6820 forward (IC250_1.10), Primary Galvanic Isolation (R401_1.2 TR400_1.12)
OUT_N: Primary LTC6820/LTC6820 reverse (IC250_2.10), Primary Galvanic Isolation (R400_1.2 TR400_1.9)
OUT_N: Secondary LTC6820/LTC6820 forward (IC250_3.10), Secondary Galvanic Isolation (R401_2.2 TR400_2.12)
OUT_N: Secondary LTC6820/LTC6820 reverse (IC250_4.10), Secondary Galvanic Isolation (R400_2.2 TR400_2.9)
OUT_P: Primary LTC6820/LTC6820 forward (IC250_1.11), Primary Galvanic Isolation (R401_1.1 TR400_1.10)
OUT_P: Primary LTC6820/LTC6820 reverse (IC250_2.11), Primary Galvanic Isolation (R400_1.1 TR400_1.7)
OUT_P: Secondary LTC6820/LTC6820 forward (IC250_3.11), Secondary Galvanic Isolation (R401_2.1 TR400_2.10)
OUT_P: Secondary LTC6820/LTC6820 reverse (IC250_4.11), Secondary Galvanic Isolation (R400_2.1 TR400_2.7)
OUT_primary_N: Primary Galvanic Isolation (TR400_1.1), slave-connector (J500.4 J502.2)
OUT_primary_P: Primary Galvanic Isolation (TR400_1.3), slave-connector (J500.3 J502.1)
OUT_reverse_primary_N: Primary Galvanic Isolation (TR400_1.4), slave-connector (J500.8 J503.2)
OUT_reverse_primary_P: Primary Galvanic Isolation (TR400_1.6), slave-connector (J500.7 J503.1)
OUT_reverse_secondary_N: Secondary Galvanic Isolation (TR400_2.4), slave-connector (J501.6 J505.2)
OUT_reverse_secondary_P: Secondary Galvanic Isolation (TR400_2.6), slave-connector (J501.5 J505.1)
OUT_secondary_N: Secondary Galvanic Isolation (TR400_2.1), slave-connector (J501.2 J504.2)
OUT_secondary_P: Secondary Galvanic Isolation (TR400_2.3), slave-connector (J501.1 J504.1)
PHA_Primary LTC6820: Primary LTC6820 (JP200_1.1 JP204_1.2), Primary LTC6820/LTC6820 forward (IC250_1.8), Primary LTC6820/LTC6820 reverse (IC250_2.8)
PHA_Secondary LTC6820: Secondary LTC6820 (JP200_2.1 JP204_2.2), Secondary LTC6820/LTC6820 forward (IC250_3.8), Secondary LTC6820/LTC6820 reverse (IC250_4.8)
POL_Primary LTC6820: Primary LTC6820 (JP201_1.1 JP205_1.2), Primary LTC6820/LTC6820 forward (IC250_1.7), Primary LTC6820/LTC6820 reverse (IC250_2.7)
POL_Secondary LTC6820: Secondary LTC6820 (JP201_2.1 JP205_2.2), Secondary LTC6820/LTC6820 forward (IC250_3.7), Secondary LTC6820/LTC6820 reverse (IC250_4.7)
SLOW_Primary LTC6820: Primary LTC6820 (JP202_1.1 JP206_1.2), Primary LTC6820/LTC6820 forward (IC250_1.13), Primary LTC6820/LTC6820 reverse (IC250_2.13)
SLOW_Secondary LTC6820: Secondary LTC6820 (JP202_2.1 JP206_2.2), Secondary LTC6820/LTC6820 forward (IC250_3.13), Secondary LTC6820/LTC6820 reverse (IC250_4.13)

## Assembly variants
default: not fitted J500 J501 J502 J503 R200_1 R200_2 R201_1 R201_2 R202_1 R202_2 R207_1 R207_2 X501 X502